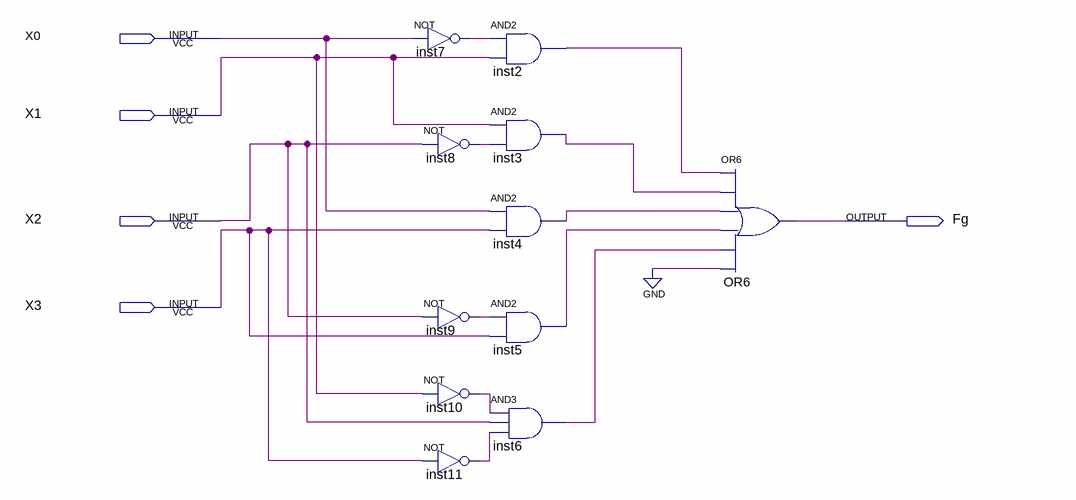
[diagram p0: schematic sheet]
// Quartus schematic Segmento7.bdf as structural Verilog: 11 symbols, 5 pins
module Segmento7 (
  input  X0,
  input  X1,
  input  X2,
  input  X3,
  output Fg
);

  wire inst2_out, inst3_out, inst4_out, inst5_out, inst6_out, inst7_out, inst8_out, inst9_out, inst10_out,
       inst11_out;

  not inst7 (inst7_out, X0);
  not inst8 (inst8_out, X2);
  not inst9 (inst9_out, X2);
  not inst10 (inst10_out, X1);
  not inst11 (inst11_out, X3);
  and inst2 (inst2_out, inst7_out, X1);
  and inst3 (inst3_out, X1, inst8_out);
  and inst4 (inst4_out, X0, X3);
  and inst5 (inst5_out, inst9_out, X3);
  and inst6 (inst6_out, inst10_out, X2, inst11_out);
  or OR6 (Fg, inst2_out, inst3_out, inst4_out, inst5_out, inst6_out, 1'b0);
endmodule
